# Altium schematic sheet SCH-microphone-module-2025-06-26.schdoc
size 281 x 203 mm
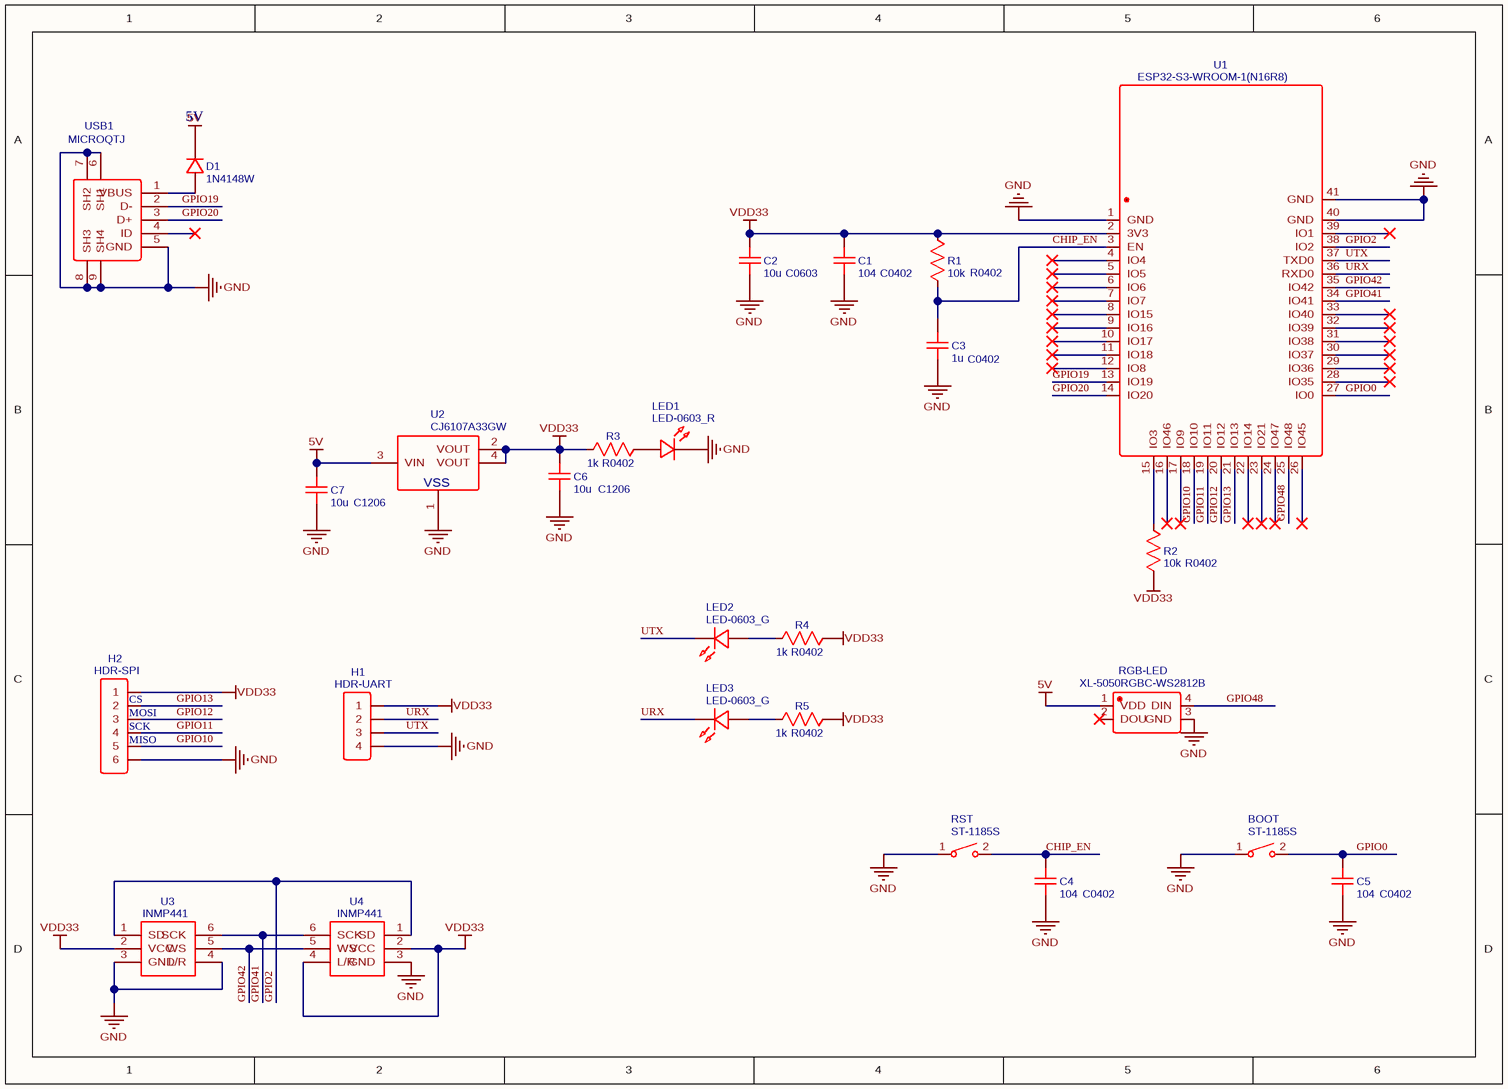
[diagram p0: SCH-microphone-module-2025-06-26.schdoc]

## Parts
BOOT  ST-1185S  [SW-SMD_ST-1185S]
C1  104  [C0402]
C2  10u  [C0603]
C3  1u  [C0402]
C4  104  [C0402]
C5  104  [C0402]
C6  10u  [C1206]
C7  10u  [C1206]
D1  1N4148W  [SOD-123FL_L2.6-W1.6-LS3.4-RD]
H1  HDR-UART  [HDR-M-2.54_1X4]
H2  HDR-SPI  [HDR-M-2.54_1X6]
LED1  LED-0603_R  [LED0603_RED]
LED2  LED-0603_G  [LED0603_GREEN]
LED3  LED-0603_G  [LED0603_GREEN]
R1  10k  [R0402]
R2  10k  [R0402]
R3  1k  [R0402]
R4  1k  [R0402]
R5  1k  [R0402]
RGB-LED  XL-5050RGBC-WS2812B  [LED-SMD_4P-L5.0-W5.0-BL_XL-5050RGBC]
RST  ST-1185S  [SW-SMD_ST-1185S]
U1  ESP32-S3-WROOM-1(N16R8)  [WIRELM-SMD_ESP32-S3-WROOM-1]
U2  CJ6107A33GW  [SOT-223-4_L6.5-W3.5-P2.30-LS7.0-BR]
U3  INMP441  [INMP441]
U4  INMP441  [INMP441]
USB1  MICROQTJ  [MICRO-USB_5S_V1]

## Nets
5V: C7.2 D1.1 RGB-LED.1(VDD) U2.3(VIN)
GND: BOOT.1 C1.1 C2.1 C3.1 C4.1 C5.1 C6.1 C7.1 H1.4 H2.6 LED1.2 RGB-LED.3(GND) RST.1 U1.1(GND) U1.40(GND) U1.41(GND) U2.1(VSS) U3.3(GND) U3.4(L/R) U4.3(GND) USB1.5(GND) USB1.6(SH1) USB1.7(SH2) USB1.8(SH3) USB1.9(SH4)
VDD33: C1.2 C2.2 C6.2 H1.1 H2.1 R1.2 R2.2 R3.1 R4.2 R5.2 U1.2(3V3) U2.2(VOUT) U2.4(VOUT) U3.2(VCC) U4.2(VCC) U4.4(L/R)
CHIP_EN: C3.2 C4.2 R1.1 RST.2 U1.3(EN)
GPIO0: BOOT.2 C5.2 U1.27(IO0)
GPIO2: U1.38(IO2) U3.1(SD) U4.1(SD)
GPIO10: H2.5 U1.18(IO10)
GPIO11: H2.4 U1.19(IO11)
GPIO12: H2.3 U1.20(IO12)
GPIO13: H2.2 U1.21(IO13)
GPIO19: U1.13(IO19) USB1.2(D-)
GPIO20: U1.14(IO20) USB1.3(D+)
GPIO41: U1.34(IO41) U3.6(SCK) U4.6(SCK)
GPIO42: U1.35(IO42) U3.5(WS) U4.5(WS)
GPIO48: RGB-LED.4(DIN) U1.25(IO48)
URX: H1.2 LED3.2 U1.36(RXD0)
UTX: H1.3 LED2.2 U1.37(TXD0)
NetD1_2: D1.2 USB1.1(VBUS)
NetLED1_1: LED1.1 R3.2
NetLED2_1: LED2.1 R4.1
NetLED3_1: LED3.1 R5.1
NetR2_1: R2.1 U1.15(IO3)

Not connected (* = marked no-connect by the designer): RGB-LED 2(DOU)*; U1 4(IO4)* 5(IO5)* 6(IO6)* 7(IO7)* 8(IO15)* 9(IO16)* 10(IO17)* 11(IO18)* 12(IO8)* 16(IO46)* 17(IO9)* 22(IO14)* 23(IO21)* 24(IO47)* 26(IO45)* 28(IO35)* 29(IO36)* 30(IO37)* 31(IO38)* 32(IO39)* 33(IO40)* 39(IO1)*; USB1 4(ID)*

## Notes on the sheet
- (near D1) 5V
- (near H2) CS
- (near H2) MOSI
- (near H2) SCK
- (near H2) MISO
- (in symbol 1k) R0402
- (in symbol 1u) C0402
- (in symbol 10k) R0402
- (in symbol 10u) C0603; C1206
- (in symbol 104) C0402

## Library data of the parts
BOOT RST = ST-1185S: Manufacturer: RISHENG(日昇); Contributor: LCSC; Supplier: LCSC; Supplier Part: C589191; Manufacturer Part: ST-1185S; JLCPCB Part Class: Extended Part; spicePre: S; spiceSymbolName: ST-1185S
C1 C4 C5 = 104: nameAlias: Value(F); Contributor: LCEDA_Lib; Package Display: Yes; spicePre: C; spiceSymbolName: C_0402_US
  C4 C5: Supplier: LCSC
C2 C6 C7 = 10u: nameAlias: Value(F); Contributor: LCEDA_Lib; Package Display: Yes; Supplier: LCSC; spicePre: C
  C2: spiceSymbolName: C_0603_US
  C6 C7: spiceSymbolName: C_1206_US
C3 = 1u: nameAlias: Value(F); Contributor: LCEDA_Lib; Package Display: Yes; Supplier: LCSC; spicePre: C; spiceSymbolName: C_0402_US
D1 = 1N4148W: Manufacturer: Tak Cheong; Contributor: LCEDA_Lib; Supplier: LCSC; Manufacturer Part: 1N4148W; Supplier Part: C129216; spicePre: D; spiceSymbolName: 1N4148W
H1 = HDR-UART: Contributor: LCEDA_Lib; Supplier Part: C225501; Supplier: LCSC; spicePre: H; spiceSymbolName: HDR-F-2.54_1x4
H2 = HDR-SPI: Contributor: LCEDA_Lib; Supplier Part: C40877; Supplier: LCSC; spicePre: H; spiceSymbolName: HDR-F-2.54_1x6
LED1 = LED-0603_R: Manufacturer: EVERLIGHT(台湾亿光); Manufacturer Part: 19-217/R6C-AL1M2VY/3T; Contributor: LCEDA_01; Supplier Part: C72044; Supplier: LCSC; spicePre: L; spiceSymbolName: LED-0603_R
LED2 LED3 = LED-0603_G: Manufacturer: EVERLIGHT(台湾亿光); Manufacturer Part: 19-217/GHC-YR1S2/3T; Contributor: LCEDA_Lib; Package Display: No; Supplier Part: C72043; Supplier: LCSC; spicePre: L; spiceSymbolName: LED-0603_G
R1 R2 = 10k: nameAlias: Value(Ω); Contributor: LCEDA_Lib; Package Display: Yes; spicePre: R; spiceSymbolName: R_0402_US
  R1: Supplier: LCSC
R3-R5 = 1k: nameAlias: Value(Ω); Contributor: LCEDA_Lib; Package Display: Yes; Supplier: LCSC; spicePre: R; spiceSymbolName: R_0402_US
RGB-LED = XL-5050RGBC-WS2812B: Manufacturer: XINGLIGHT(成兴光); Contributor: LCSC; Supplier: LCSC; Supplier Part: C2843785; Manufacturer Part: XL-5050RGBC-WS2812B; spicePre: L; spiceSymbolName: XL-5050RGBC-WS2812B
U1 = ESP32-S3-WROOM-1(N16R8): Manufacturer: ESPRESSIF(乐鑫); Manufacturer Part: ESP32-S3-WROOM-1-N16R8; Contributor: lcsc; Package Display: No; Supplier: LCSC; Supplier Part: C2913202; spicePre: U; spiceSymbolName: ESP32-S3-WROOM-1(N16R8)
U2 = CJ6107A33GW: Manufacturer: CJ(江苏长电/长晶); Contributor: LCSC; Supplier: LCSC; Supplier Part: C2829350; Manufacturer Part: CJ6107A33GW; JLCPCB Part Class: Extended Part; spicePre: U; spiceSymbolName: CJ6107A33GW
U3 U4 = INMP441: Contributor: venuraju; Manufacturer Part: INMP441; spicePre: U; spiceSymbolName: INMP441
USB1 = MICROQTJ: Manufacturer: SHOU HAN(首韩); Contributor: LCSC; Supplier: LCSC; Supplier Part: C404968; Manufacturer Part: MicroQTJ; JLCPCB Part Class: Extended Part; spicePre: U; spiceSymbolName: MICROQTJ